# Altium schematic sheet 02 ESP32.SchDoc
size A3; SheetNumber: 3; SheetTotal: 5
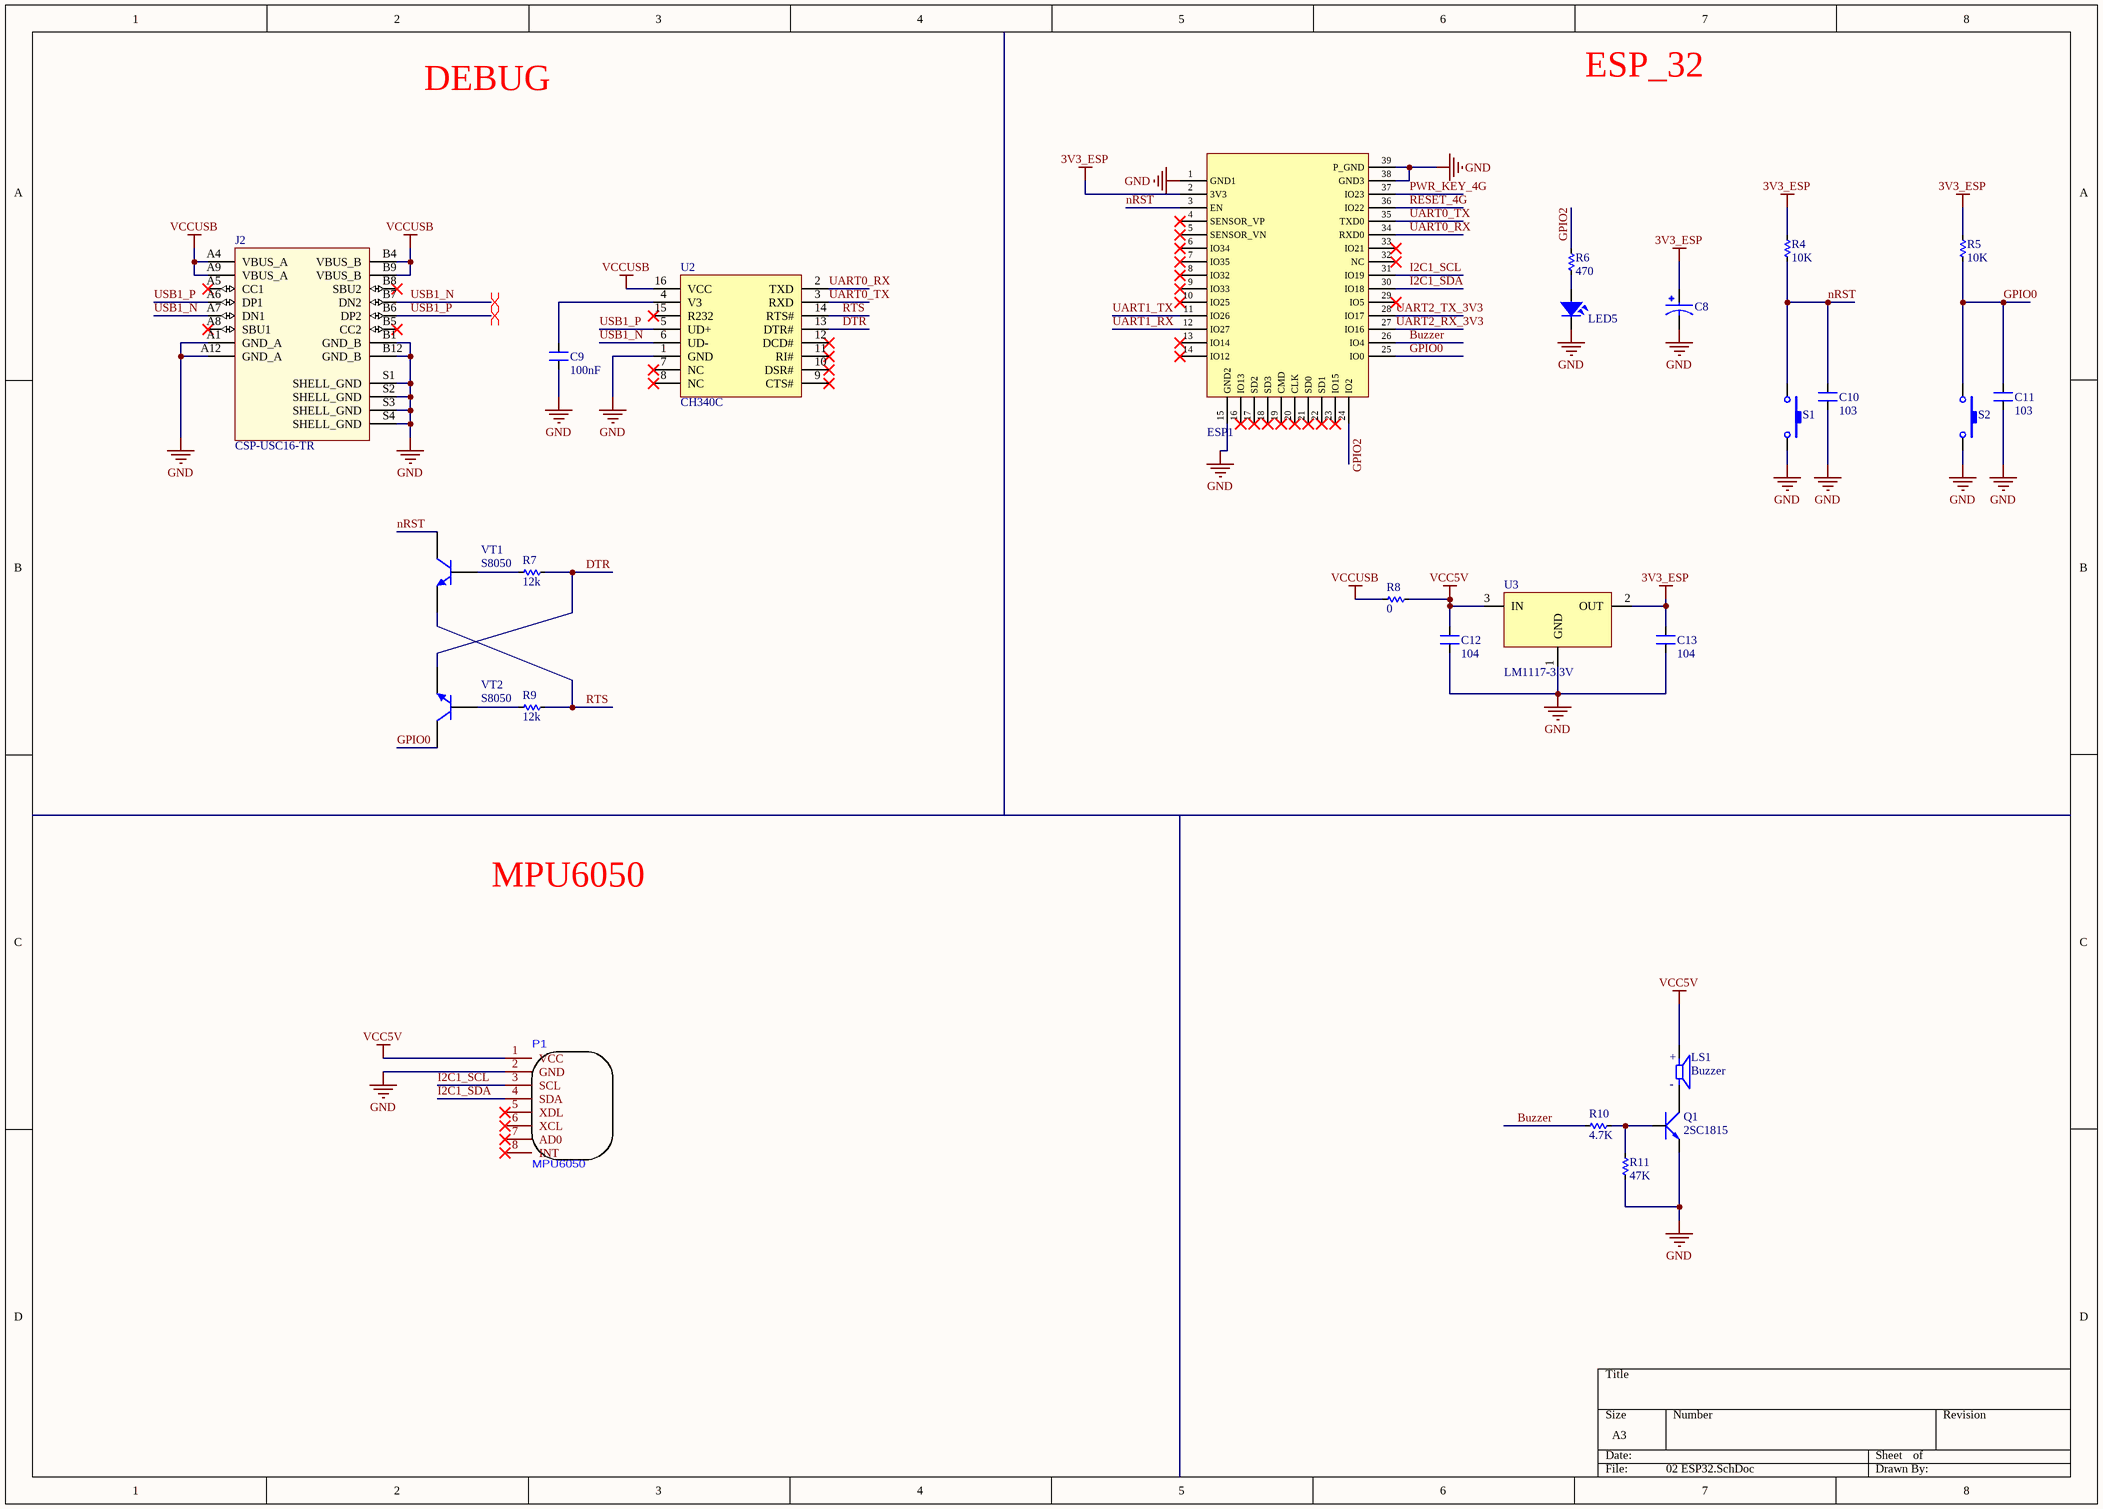
[diagram p0: 02 ESP32.SchDoc]

## Parts
C8  CAP_TANTALUM_SMD  [CAP_TANTALUM_3216]  (value not drawn)
C9  100nF  [C 0603]
C10  103  [C-0603]
C11  103  [C-0603]
C12  104  [C 0603]
C13  104  [C 0603]
ESP1  ESP32  [ESP_WROOM_32]  (value not drawn)
J2  CSP-USC16-TR  [VALCON_CSP-USC16-TR]
LED5  LED  [LED-0603]  (value not drawn)
LS1  Buzzer  [Buzzer-9MM]
P1  MPU6050  [MPU6050]
Q1  2SC1815  [SOT23-321]
R4  10K  [RES-SMD-0603]
R5  10K  [RES-SMD-0603]
R6  470  [RES-SMD-0402]
R7  12k  [RES-SMD-0402]
R8  0  [RES-SMD-0603]
R9  12k  [RES-SMD-0402]
R10  4.7K  [RES-SMD-0603]
R11  47K  [RES-SMD-0603]
S1  SW-SMD  [SW_B3U-1000P]  (value not drawn)
S2  SW-SMD  [SW_B3U-1000P]  (value not drawn)
U2  CH340C  [SOIC16_50_284_25X90_SMT]
U3  LM1117-3.3V  [SOT223]
VT1  S8050  [SMT_TRIODE_NPN]
VT2  S8050  [SMT_TRIODE_NPN]

## Nets
3V3_ESP: C8.1 C13.1 ESP1.2(3V3) R4.1 R5.1 U3.2(OUT)
GND: C8.2 C9.1 C10.1 C11.1 C12.2 C13.2 ESP1.1(GND1) ESP1.15(GND2) ESP1.38(GND3) ESP1.39(P_GND) J2.A1(GND_A) J2.A12(GND_A) J2.B1(GND_B) J2.B12(GND_B) J2.S1(SHELL_GND) J2.S2(SHELL_GND) J2.S3(SHELL_GND) J2.S4(SHELL_GND) LED5.2 P1.2(GND) Q1.1(E) R11.1 S1.2 S2.2 U2.1(GND) U3.1(GND)
VCC5V: C12.1 LS1.1(P) P1.1(VCC) R8.1 U3.3(IN)
VCCUSB: J2.A4(VBUS_A) J2.A9(VBUS_A) J2.B4(VBUS_B) J2.B9(VBUS_B) R8.2 U2.16(VCC)
Buzzer: ESP1.26(IO4) R10.1
DTR: R7.1 U2.13(DTR#) VT2.2(E)
GPIO0: C11.2 ESP1.25(IO0) R5.2 S2.1 VT2.3(C)
GPIO2: ESP1.24(IO2) R6.2
I2C1_SCL: ESP1.31(IO19) P1.3(SCL)
I2C1_SDA: ESP1.30(IO18) P1.4(SDA)
nRST: C10.2 ESP1.3(EN) R4.2 S1.1 VT1.3(C)
PWR_KEY_4G: ESP1.37(IO23)
RESET_4G: ESP1.36(IO22)
RTS: R9.1 U2.14(RTS#) VT1.2(E)
UART0_RX: ESP1.34(RXD0) U2.2(TXD)
UART0_TX: ESP1.35(TXD0) U2.3(RXD)
UART1_RX: ESP1.12(IO27)
UART1_TX: ESP1.11(IO26)
UART2_RX_3V3: ESP1.27(IO16)
UART2_TX_3V3: ESP1.28(IO17)
USB1_N: J2.A7(DN1) J2.B7(DN2) U2.6(UD-)
USB1_P: J2.A6(DP1) J2.B6(DP2) U2.5(UD+)
NetC9_2: C9.2 U2.4(V3)
NetLED5_1: LED5.1 R6.1
NetLS1_2: LS1.2(M) Q1.2(C)
NetQ1_3: Q1.3(B) R10.2 R11.2
NetR7_2: R7.2 VT1.1(B)
NetR9_2: R9.2 VT2.1(B)

Not connected (* = marked no-connect by the designer): ESP1 4(SENSOR_VP)* 5(SENSOR_VN)* 6(IO34)* 7(IO35)* 8(IO32)* 9(IO33)* 10(IO25)* 13(IO14)* 14(IO12)* 16(IO13)* 17(SD2)* 18(SD3)* 19(CMD)* 20(CLK)* 21(SD0)* 22(SD1)* 23(IO15)* 29(IO5)* 32(NC)* 33(IO21)*; J2 A5(CC1)* A8(SBU1)* B5(CC2)* B8(SBU2)*; P1 5(XDL)* 6(XCL)* 7(AD0)* 8(INT)*; U2 7(NC)* 8(NC)* 9(CTS#)* 10(DSR#)* 11(RI#)* 12(DCD#)* 15(R232)*

## Layout directives
differential pair: USB1_N, USB1_P

## Notes on the sheet
- DEBUG
- ESP_32
- MPU6050
- (in symbol Buzzer) +; -

## Library data of the parts
C8 = CAP_TANTALUM_SMD: Capacitor, Tantalum; MF: AVX; MP: TAJB475K025RNJ; SnapEDA_Link: https://www.snapeda.com/parts/TAJB475K025RNJ/AVX/view-part/?ref=snap; Package: 1411 AVX Corporation; Value: *; Check_prices: https://www.snapeda.com/parts/TAJB475K025RNJ/AVX/view-part/?ref=eda
C9 C12 C13 = CAP_SMD: Value: 33pF
C10 C11 = CM: Cap SMD; Value: 103
ESP1 = ESP-WROOM-32
J2 = CSP-USC16-TR: CSP-USC16-TR Valcon USB Type C Surface Mount PCB Socket; Package: None; Purchase-URL: https://pricing.snapeda.com/search/part/CSP-USC16-TR/?ref=eda; MP: CSP-USC16-TR; Check_prices: https://www.snapeda.com/parts/CSP-USC16-TR/Valcon/view-part/4783629/?ref=eda; MF: Valcon; Value: *; Availability: No availability data; Price: None; SnapEDA_Link: https://www.snapeda.com/parts/CSP-USC16-TR/Valcon/view-part/4783629/?ref=snap
LED5 = LED SMD: Value: LED 3 - 5 ly 2 Colour
LS1 = Buzzer: MP: CST-951AP; Availability: Unavailable; Price: None; Value: *; Package: None
Q1 = 2SC1815: NPN 600mW, ECB; Value: C1815
R4 R5 R8 R10 R11 = Res-SMD: Resistor; Manufacturer: Generic Components; Class: Passive; Published: 08/06/2000; Publisher: Altium Hobart Technology Centre
R6 R7 R9 = Res-SMD: RES_SMD; Manufacturer: Generic Components; Class: Passive; Published: 08/06/2000; Publisher: Altium Hobart Technology Centre
S1 S2 = SW-SMD: Switch; Published: 24-Mar-1999; LatestRevisionDate: 17-Jul-2002; LatestRevisionNote: Re-released for DXP Platform.; PackageReference: SPST-2; Publisher: Altium Limited
U2 = CH340C: USB Bridge, USB to UART USB 2.0 UART Interface; Manufacturer: Olimex; Alternate Part Number-1: NA; Manufacturer Part Number: CH340C; Case/Package: SOIC16; Supplier-1: LCSC; Supplier Part Number-1: C84681
U3 = LM1117: 800mA Low-Dropout Linear Regulator; Creator: Nguyen Ba Bien; Website: http://group3i.net
VT1 VT2 = SMT_TRIODE_NPN: Surface mount NPN transistor, package SOT-23